# Altium project WatchX2_RoundScreen.PrjPcb
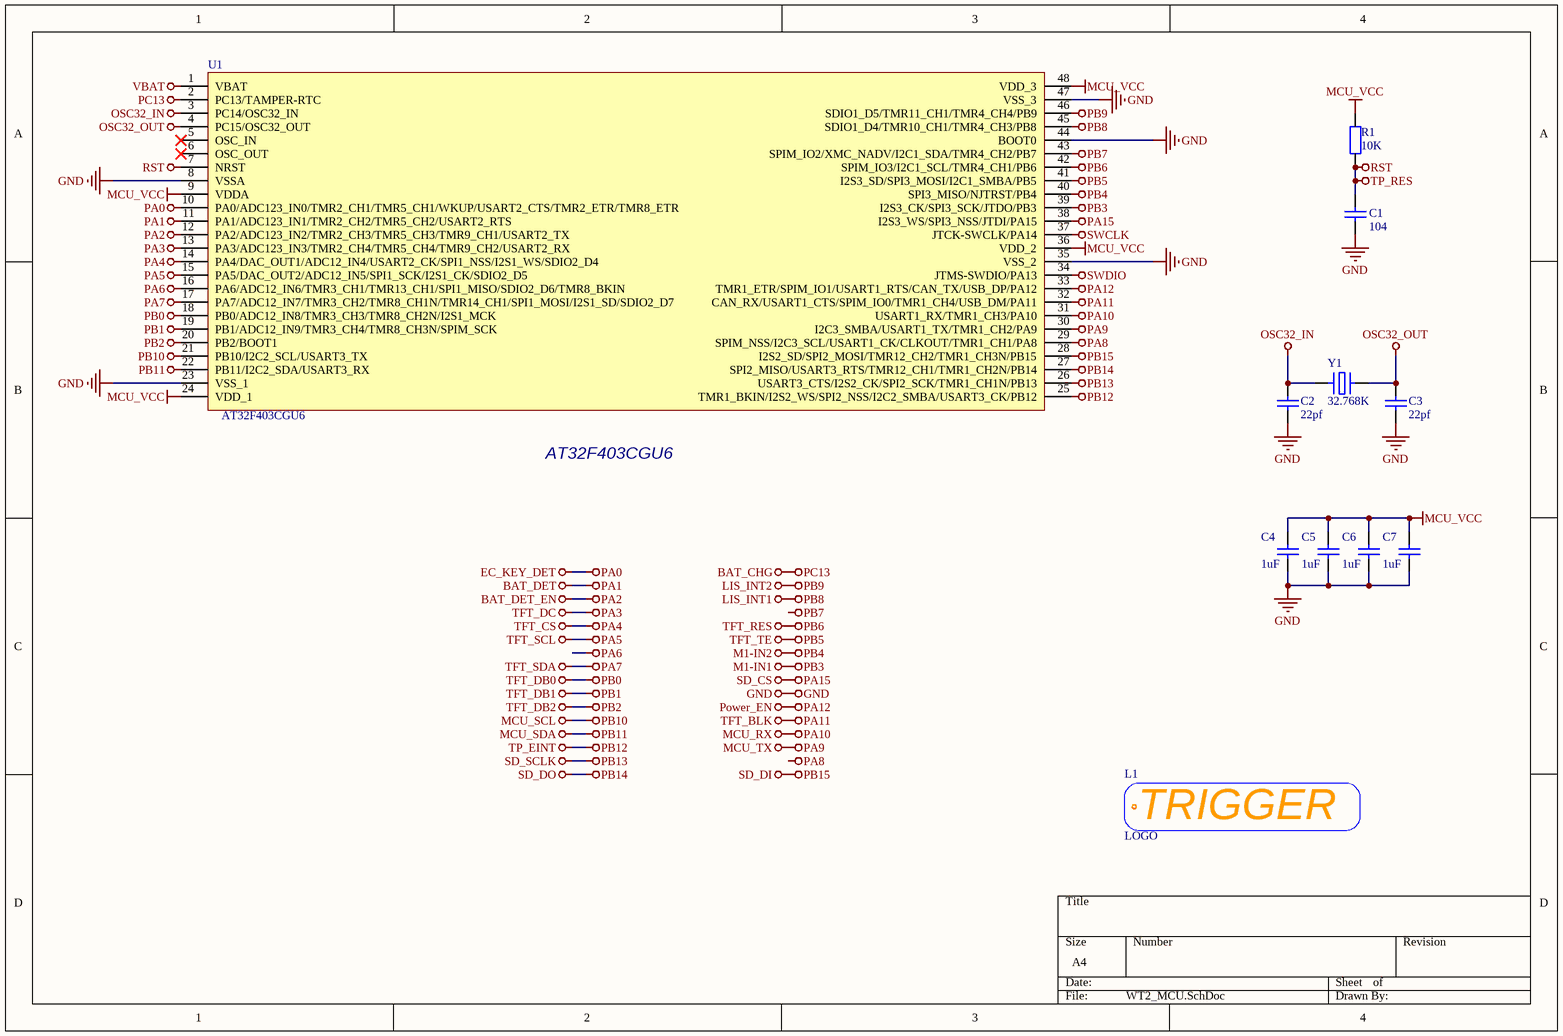
[diagram p0: WT2_MCU.SchDoc]
5 sheets, 92 parts. Net scope: global (net labels, ports and power ports of the same name join across sheets).
Board file: WatchX2_RoundScreen.PcbDoc
Sheets:
  WT2_MCU.SchDoc
  WT2_Ports.SchDoc
  WT2_Power.SchDoc
  WT2_Screen.SchDoc
  WT2_Sensors.SchDoc

## Sheet WT2_MCU.SchDoc
size A4

### Parts
C1  104  [电容_C0402]
C2  22pf  [电容_C0402]
C3  22pf  [电容_C0402]
C4  1uF  [电容_C0402]
C5  1uF  [电容_C0402]
C6  1uF  [电容_C0402]
C7  1uF  [电容_C0402]
L1  LOGO  [LOGO REV L BS]
R1  10K  [电阻_R0402]
U1  AT32F403CGU6  [AT主控_QFN48(6X6)]
Y1  32.768K  [晶振_3215]

### Nets
BAT_CHG: U1.2(PC13/TAMPER-RTC)  [also labelled PC13]
BAT_DET: U1.11(PA1/ADC123_IN1/TMR2_CH2/TMR5_CH2/USART2_RTS)  [also labelled PA1]
BAT_DET_EN: U1.12(PA2/ADC123_IN2/TMR2_CH3/TMR5_CH3/TMR9_CH1/USART2_TX)  [also labelled PA2]
EC_KEY_DET: U1.10(PA0/ADC123_IN0/TMR2_CH1/TMR5_CH1/WKUP/USART2_CTS/TMR2_ETR/TMR8_ETR)  [also labelled PA0]
GND: C1.1 C2.2 C3.2 C4.1 C5.1 C6.1 C7.1 U1.0(VSS) U1.8(VSSA) U1.23(VSS_1) U1.35(VSS_2) U1.44(BOOT0) U1.47(VSS_3)
LIS_INT1: U1.45(SDIO1_D4/TMR10_CH1/TMR4_CH3/PB8)  [also labelled PB8]
LIS_INT2: U1.46(SDIO1_D5/TMR11_CH1/TMR4_CH4/PB9)  [also labelled PB9]
M1-IN1: U1.39(I2S3_CK/SPI3_SCK/JTDO/PB3)  [also labelled PB3]
M1-IN2: U1.40(SPI3_MISO/NJTRST/PB4)  [also labelled PB4]
MCU_RX: U1.31(USART1_RX/TMR1_CH3/PA10)  [also labelled PA10]
MCU_SCL: U1.21(PB10/I2C2_SCL/USART3_TX)  [also labelled PB10]  [project net ASCL]
MCU_SDA: U1.22(PB11/I2C2_SDA/USART3_RX)  [also labelled PB11]  [project net ASDA]
MCU_TX: U1.30(I2C3_SMBA/USART1_TX/TMR1_CH2/PA9)  [also labelled PA9]
MCU_VCC: C4.2 C5.2 C6.2 C7.2 R1.2 U1.9(VDDA) U1.24(VDD_1) U1.36(VDD_2) U1.48(VDD_3)  [project net 3V3]
OSC32_IN: C2.1 U1.3(PC14/OSC32_IN) Y1.1
OSC32_OUT: C3.1 U1.4(PC15/OSC32_OUT) Y1.2
PA3: U1.13(PA3/ADC123_IN3/TMR2_CH4/TMR5_CH4/TMR9_CH2/USART2_RX)  [also labelled TFT_DC]
PA4: U1.14(PA4/DAC_OUT1/ADC12_IN4/USART2_CK/SPI1_NSS/I2S1_WS/SDIO2_D4)  [also labelled TFT_CS]
PA5: U1.15(PA5/DAC_OUT2/ADC12_IN5/SPI1_SCK/I2S1_CK/SDIO2_D5)  [also labelled TFT_SCL]
PA6: U1.16(PA6/ADC12_IN6/TMR3_CH1/TMR13_CH1/SPI1_MISO/SDIO2_D6/TMR8_BKIN)
PA7: U1.17(PA7/ADC12_IN7/TMR3_CH2/TMR8_CH1N/TMR14_CH1/SPI1_MOSI/I2S1_SD/SDIO2_D7)  [also labelled TFT_SDA]
PA8: U1.29(SPIM_NSS/I2C3_SCL/USART1_CK/CLKOUT/TMR1_CH1/PA8)
PA11: U1.32(CAN_RX/USART1_CTS/SPIM_IO0/TMR1_CH4/USB_DM/PA11)  [also labelled TFT_BLK]
PA12: U1.33(TMR1_ETR/SPIM_IO1/USART1_RTS/CAN_TX/USB_DP/PA12)  [also labelled Power_EN]
PB0: U1.18(PB0/ADC12_IN8/TMR3_CH3/TMR8_CH2N/I2S1_MCK)  [also labelled TFT_DB0]
PB1: U1.19(PB1/ADC12_IN9/TMR3_CH4/TMR8_CH3N/SPIM_SCK)  [also labelled TFT_DB1]
PB2: U1.20(PB2/BOOT1)  [also labelled TFT_DB2]
PB5: U1.41(I2S3_SD/SPI3_MOSI/I2C1_SMBA/PB5)  [also labelled TFT_TE]
PB6: U1.42(SPIM_IO3/I2C1_SCL/TMR4_CH1/PB6)  [also labelled TFT_RES]
PB7: U1.43(SPIM_IO2/XMC_NADV/I2C1_SDA/TMR4_CH2/PB7)
PB12: U1.25(TMR1_BKIN/I2S2_WS/SPI2_NSS/I2C2_SMBA/USART3_CK/PB12)  [also labelled TP_EINT]
RST: C1.2 R1.1 U1.7(NRST)  [also labelled TP_RES]
SD_CS: U1.38(I2S3_WS/SPI3_NSS/JTDI/PA15)  [also labelled PA15]
SD_DI: U1.28(I2S2_SD/SPI2_MOSI/TMR12_CH2/TMR1_CH3N/PB15)  [also labelled PB15]
SD_DO: U1.27(SPI2_MISO/USART3_RTS/TMR12_CH1/TMR1_CH2N/PB14)  [also labelled PB14]
SD_SCLK: U1.26(USART3_CTS/I2S2_CK/SPI2_SCK/TMR1_CH1N/PB13)  [also labelled PB13]
SWCLK: U1.37(JTCK-SWCLK/PA14)
SWDIO: U1.34(JTMS-SWDIO/PA13)
VBAT: U1.1(VBAT)

Not connected (* = marked no-connect by the designer): U1 5(OSC_IN)* 6(OSC_OUT)*

### Notes on the sheet
- (near U1) AT32F403CGU6
- Labels drawn without touching a wire or pin: PA8, PB7
- (in symbol LOGO_TRIGGER) TRIGGER

### Library data of the parts
C1-C7 = cap: U: 50V; 参数: Cap,0805,X7R,104K,50V,125C,±10%
  C1: C: 104
  C2 C3: C: 22pf
  C4-C7: C: 1uF
L1 = LOGO_TRIGGER
R1 = Res: P: 1/8W; 参数: Res,0805,0R,±1%,1/8W,100ppm,155C; R: 10K
U1 = AT32F403CGU6: _Footprint: QFN48; _Comma: ,; _Name: MCU; _Specification: MCU,AT32F403CGU6,QFN48; _Model: AT32F403CGU6
Y1 = XTAL_A: _Name: CRYSTALS; _Comma: ,; _Specification: CRYSTALS,32.768K,*,10ppm,12pF; _Accuracy: 10ppm; _CL: 12pF; _Footprint: *; _Frequency: 32.768K

## Sheet WT2_Ports.SchDoc
size A4
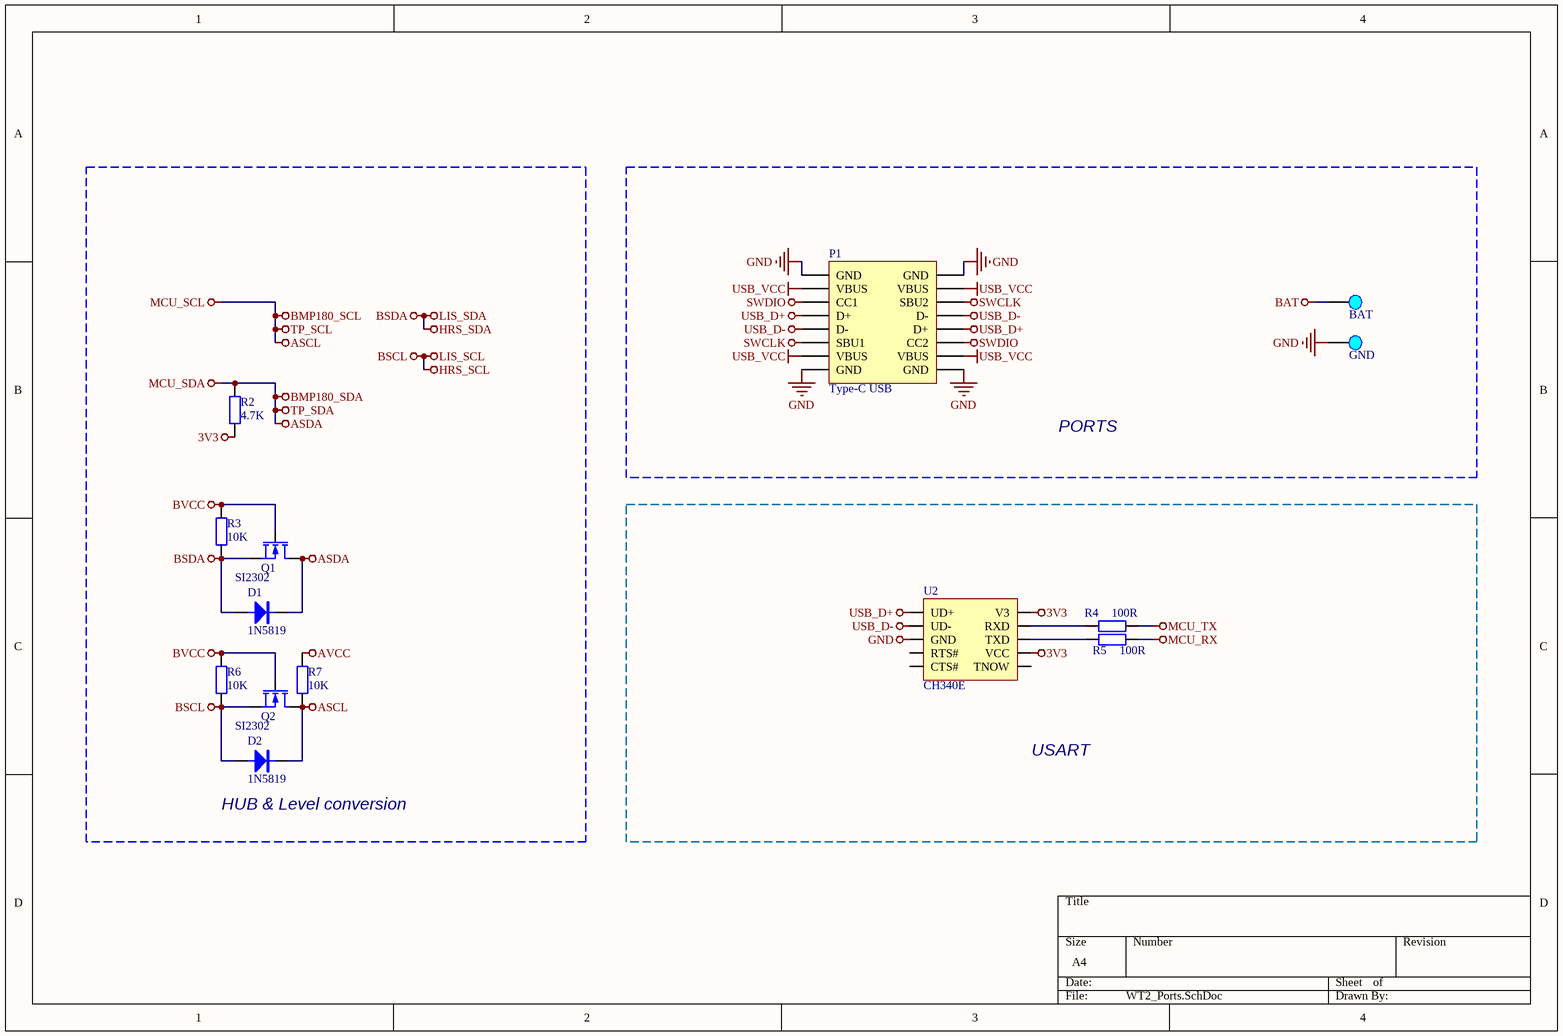
[diagram p1: WT2_Ports.SchDoc]

### Parts
D1  1N5819  [二极管_SOD-323]
D2  1N5819  [二极管_SOD-323]
P1  Type-C USB  [Type-C_16P]
Pad1  BAT  [Pad_A]
Pad2  GND  [Pad_A]
Q1  SI2302  [MOS_SOT-23]
Q2  SI2302  [MOS_SOT-23]
R2  4.7K  [电阻_R0402]
R3  10K  [电阻_R0402]
R4  100R  [电阻_R0402]
R5  100R  [电阻_R0402]
R6  10K  [电阻_R0402]
R7  10K  [电阻_R0402]
U2  CH340E  [MSOP10]

### Blocks framed on the sheet
HUB & Level conversion: D1 D2 Q1 Q2 R2 R3 R6 R7
PORTS: P1 Pad1 Pad2
USART: R4 R5 U2

### Nets
3V3: R2.1 R7.1 U2.7(VCC) U2.10(V3)  [also labelled AVCC]
ASCL: D2.K Q2.2(D) R7.2  [also labelled BMP180_SCL, MCU_SCL, TP_SCL]
ASDA: D1.K Q1.2(D) R2.2  [also labelled BMP180_SDA, MCU_SDA, TP_SDA]
BAT: Pad1.1
BSCL: D2.A Q2.3(S) R6.2  [also labelled HRS_SCL, LIS_SCL]
BSDA: D1.A Q1.3(S) R3.2  [also labelled HRS_SDA, LIS_SDA]
BVCC: Q1.1(G) Q2.1(G) R3.1 R6.1  [project net 1.8V]
GND: P1.0(GND) P1.A1(GND) P1.A12(GND) P1.B1(GND) P1.B12(GND) Pad2.1 U2.3(GND)
MCU_RX: R5.1
MCU_TX: R4.1
SWCLK: P1.A8(SBU1) P1.B8(SBU2)
SWDIO: P1.A5(CC1) P1.B5(CC2)
USB_D+: P1.A6(D+) P1.B6(D+) U2.1(UD+)
USB_D-: P1.A7(D-) P1.B7(D-) U2.2(UD-)
USB_VCC: P1.A4(VBUS) P1.A9(VBUS) P1.B4(VBUS) P1.B9(VBUS)
NetR4_2: R4.2 U2.9(RXD)
NetR5_2: R5.2 U2.8(TXD)

Not connected (* = marked no-connect by the designer): U2 4(RTS#) 5(CTS#) 6(TNOW)

### Library data of the parts
D1 D2 = Diode: _Specification: Diode,1N5819,SOD-323,1A,40V; _Comma: ,; _Footprint: SOD-323; _Voltage: 40V; _Current: 1A; _Name: Diode; _Model: 1N5819
P1 = Type-C USB Easy 16PIN: _Comma: ,; _Name: Port; _Specification: Port,Type-C USB,16PIN; _Value: 16PIN; _Model: Type-C USB
Pad1 = Pad: _Funcyusa: Test; _Specification: Pad,Test,BAT; _Comma: ,; _Name: Pad; _Remarks: BAT
Pad2 = Pad: _Funcyusa: Test; _Specification: Pad,Test,GND; _Comma: ,; _Name: Pad; _Remarks: GND
Q1 Q2 = MOSFET-N: _Comma: ,; _Current: 150A; _Footprint: DFN5*6; _Name: N-MOSFET; _Specification: N-MOSFET,SI2302,DFN5*6,150A,30V; _Voltage: 30V; _Model: SI2302
R2-R7 = Res: as R1 on sheet WT2_MCU
  R2: R: 4.7K
  R3 R6 R7: R: 10K
  R4 R5: R: 100R

## Sheet WT2_Power.SchDoc
size A4
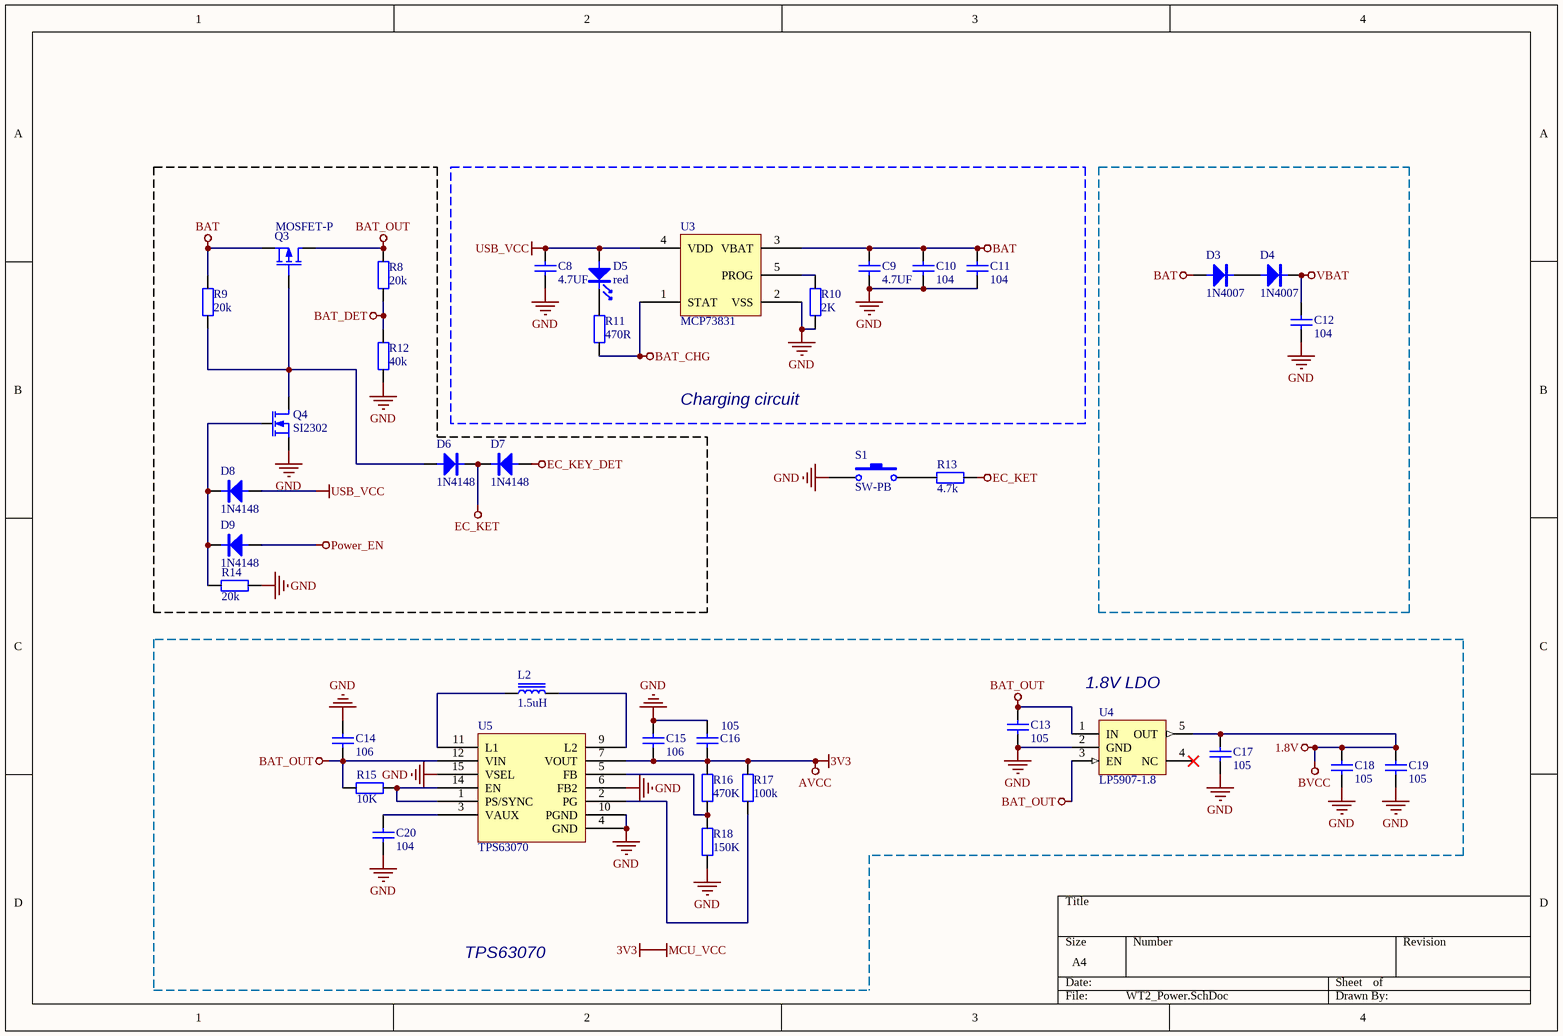
[diagram p2: WT2_Power.SchDoc]

### Parts
C8  4.7UF  [电容_C0805]
C9  4.7UF  [电容_C0805]
C10  104  [电容_C0402]
C11  104  [电容_C0402]
C12  104  [电容_C0402]
C13  105  [电容_C0402]
C14  106  [电容_C0805]
C15  106  [电容_C0603]
C16  105  [电容_C0402]
C17  105  [电容_C0402]
C18  105  [电容_C0402]
C19  105  [电容_C0402]
C20  104  [电容_C0402]
D3  1N4007  [二极管_SOD-323]
D4  1N4007  [二极管_SOD-323]
D5  red  [LED_0603]
D6  1N4148  [二极管_SOD-323]
D7  1N4148  [二极管_SOD-323]
D8  1N4148  [二极管_SOD-323]
D9  1N4148  [二极管_SOD-323]
L2  1.5uH  [变压器电感_0420]
Q3  MOSFET-P  [SOT23]
Q4  SI2302  [MOS_SOT-23]
R8  20k  [电阻_R0402]
R9  20k  [电阻_R0402]
R10  2K  [电阻_R0402]
R11  470R  [电阻_R0402]
R12  40k  [电阻_R0402]
R13  4.7k  [电阻_R0402]
R14  20k  [电阻_R0402]
R15  10K  [电阻_R0402]
R16  470K  [电阻_R0402]
R17  100k  [电阻_R0402]
R18  150K  [电阻_R0402]
S1  SW-PB  [KEY-TE26EA]
U3  MCP73831  [SOT23-5]
U4  LP5907-1.8  [SOT23-5]
U5  TPS63070  [VQFN-15-HR]

### Blocks framed on the sheet
Charging circuit: C8-C11 D5 R10 R11 U3

### Nets
1.8V: C17.2 C18.2 C19.2 U4.5(OUT)  [also labelled BVCC]
3V3: C15.1 C16.1 R16.1 R17.1 U5.7(VOUT)  [also labelled AVCC, MCU_VCC]
BAT: C9.2 C10.1 C11.1 D3.A Q3.3(S) R9.2 U3.3(VBAT)
BAT_CHG: R11.1 U3.1(STAT)
BAT_DET: R8.1 R12.2
BAT_OUT: C13.2 C14.1 Q3.2(D) R8.2 R15.2 U4.1(IN) U4.3(EN) U5.12(VIN)
EC_KET: D6.K D7.K R13.1
EC_KEY_DET: D7.A
GND: C8.1 C9.1 C10.2 C11.2 C12.2 C13.1 C14.2 C15.2 C16.2 C17.1 C18.1 C19.1 C20.1 Q4.3(S) R10.1 R12.1 R14.1 R18.2 S1.1 U3.2(VSS) U4.2(GND) U5.4(GND) U5.6(FB2) U5.10(PGND) U5.15(VSEL)
Power_EN: D9.A  [project net PA12]
USB_VCC: C8.2 D5.A D8.A U3.4(VDD)
VBAT: C12.1 D4.K
NetC20_2: C20.2 U5.3(VAUX)
NetD3_K: D3.K D4.A
NetD5_K: D5.K R11.2
NetD6_A: D6.A Q3.1(G) Q4.2(D) R9.1
NetD8_K: D8.K D9.K Q4.1(G) R14.2
NetL2_1: L2.1 U5.11(L1)
NetL2_2: L2.2 U5.9(L2)
NetR10_2: R10.2 U3.5(PROG)
NetR13_2: R13.2 S1.2
NetR15_1: R15.1 U5.1(PS/SYNC) U5.14(EN)
NetR16_2: R16.2 R18.1 U5.5(FB)
NetR17_2: R17.2 U5.2(PG)

Not connected (* = marked no-connect by the designer): U4 4(NC)*

### Notes on the sheet
- (near U4) 1.8V LDO
- TPS63070

### Library data of the parts
C8-C20 = cap: as C1 on sheet WT2_MCU
  C8 C9: C: 4.7UF
  C10-C12 C20: C: 104
  C13 C16-C19: C: 105
  C14 C15: C: 106
D3 D4 = Diode: _Specification: Diode,1N4007,SOD-323,1A,40V; _Comma: ,; _Footprint: SOD-323; _Voltage: 40V; _Current: 1A; _Name: Diode; _Model: 1N4007
D5 = LED: 参数: LED,0603,Red
D6-D9 = Diode: _Specification: Diode,1N4148,SOD-323,1A,40V; _Comma: ,; _Footprint: SOD-323; _Voltage: 40V; _Current: 1A; _Name: Diode; _Model: 1N4148
L2 = Inductor Iron 2: _Current: 10A; _Accuracy: 20%; _Footprint: 1040; _Name: IND; _Specification: IND,1040,1.5uH,10A,20%; _Comma: ,; _Value: 1.5uH
Q3 = MOSFET-P: P-Channel MOSFET; Published: 8-Jun-2000; LatestRevisionDate: 17-Jul-2002; LatestRevisionNote: Re-released for DXP Platform.; PackageVersion: 1995/1996; PackageReference: E3; Publisher: Altium Limited; PackageDescription: TO, Flat Index; 3 In-Line, Axial Leads; Body Dia. 4.6mm; Lead Dia. 0.5 mm (max)
Q4 = MOSFET-N: as Q1 on sheet WT2_Ports; _Model: SI2302
R8-R18 = Res: as R1 on sheet WT2_MCU
  R8 R9 R14: R: 20k
  R10: R: 2K
  R11: R: 470R
  R12: R: 40k
  R13: R: 4.7k
  R15: R: 10K
  R16: R: 470K
  R17: R: 100k
  R18: R: 150K
S1 = SW-PB: 按键
U3 = MCP73831: 线性充电管理控制器
U4 = LP5907: LDO
U5 = TPS63070: 降压-升压转换器

## Sheet WT2_Screen.SchDoc
size A4
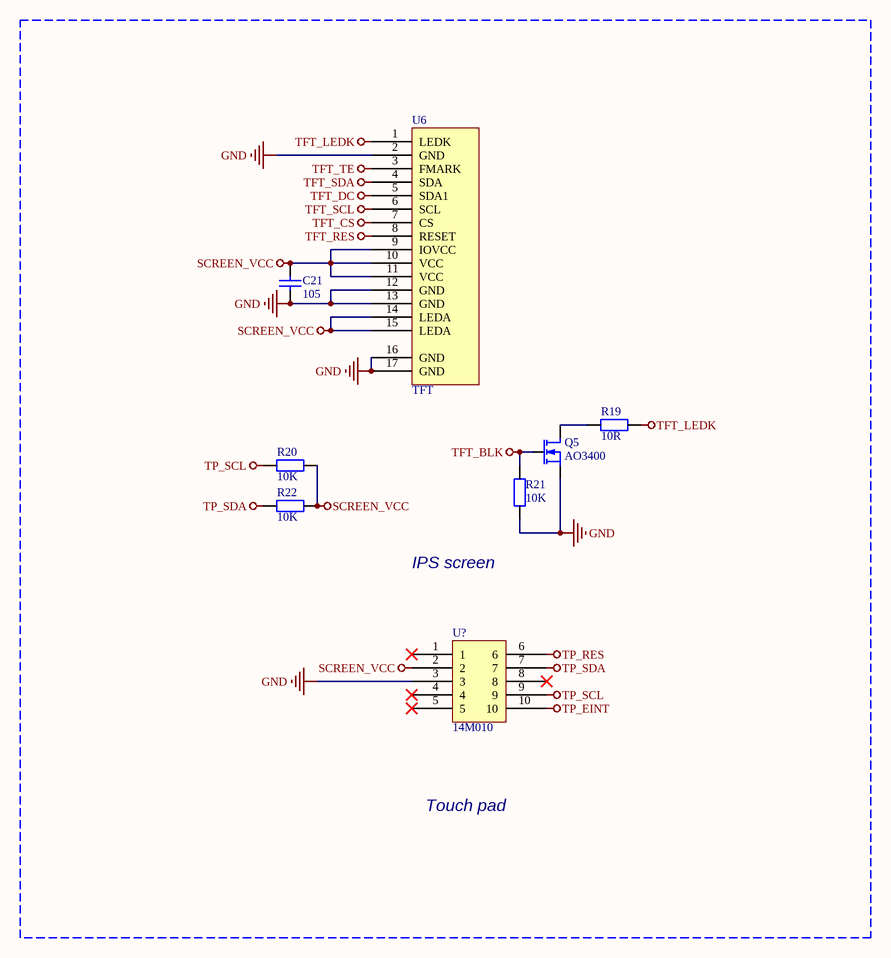
[diagram p3: WT2_Screen.SchDoc]

### Parts
C21  105  [电容_C0603]
Q5  AO3400  [MOS_SOT-23]
R19  10R  [电阻_R0402]
R20  10K  [电阻_R0402]
R21  10K  [电阻_R0402]
R22  10K  [电阻_R0402]
U6  TFT  [FPC-0.30mm-15P]
U?  14M010  [OK-14F010 10PIN]

### Nets
GND: C21.2 Q5.3(S) R21.1 U6.2(GND) U6.12(GND) U6.13(GND) U6.16(GND) U6.17(GND) U?.3
SCREEN_VCC: C21.1 R20.1 R22.1 U6.9(IOVCC) U6.10(VCC) U6.11(VCC) U6.14(LEDA) U6.15(LEDA) U?.2
TFT_BLK: Q5.1(G) R21.2  [project net PA11]
TFT_CS: U6.7(CS)  [project net PA4]
TFT_DC: U6.5(SDA1)  [project net PA3]
TFT_LEDK: R19.2 U6.1(LEDK)
TFT_RES: U6.8(RESET)  [project net PB6]
TFT_SCL: U6.6(SCL)  [project net PA5]
TFT_SDA: U6.4(SDA)  [project net PA7]
TFT_TE: U6.3(FMARK)  [project net PB5]
TP_EINT: U?.10  [project net PB12]
TP_RES: U?.6  [project net RST]
TP_SCL: R20.2 U?.9  [project net ASCL]
TP_SDA: R22.2 U?.7  [project net ASDA]
NetQ5_2: Q5.2(D) R19.1

Not connected (* = marked no-connect by the designer): U? 1* 4* 5* 8*

### Notes on the sheet
- IPS screen
- Touch pad

### Library data of the parts
C21 = cap: as C1 on sheet WT2_MCU; C: 105
Q5 = MOSFET-N: _Comma: ,; _Current: 150A; _Footprint: DFN5*6; _Name: N-MOSFET; _Specification: N-MOSFET,AO3400,DFN5*6,150A,30V; _Voltage: 30V; _Model: AO3400
R19 = Res: _Accuracy: 1%; _Power: 1/8W; _Footprint: 0805; _Drift: 100ppm; _Comma: ,; _Specification: Res,0805,10R,1%,1/8W,100ppm; _Name: Res; _Value: 10R
R20-R22 = Res: _Accuracy: 1%; _Power: 1/8W; _Footprint: 0805; _Drift: 100ppm; _Comma: ,; _Specification: Res,0805,10K,1%,1/8W,100ppm; _Name: Res; _Value: 10K
U6 = TFT_IPS1-1.54寸240*240-AML015410V1: IPS电容式触摸屏
U? = OK-14M010-04: 奇亚板对板连接器

## Sheet WT2_Sensors.SchDoc
size A4
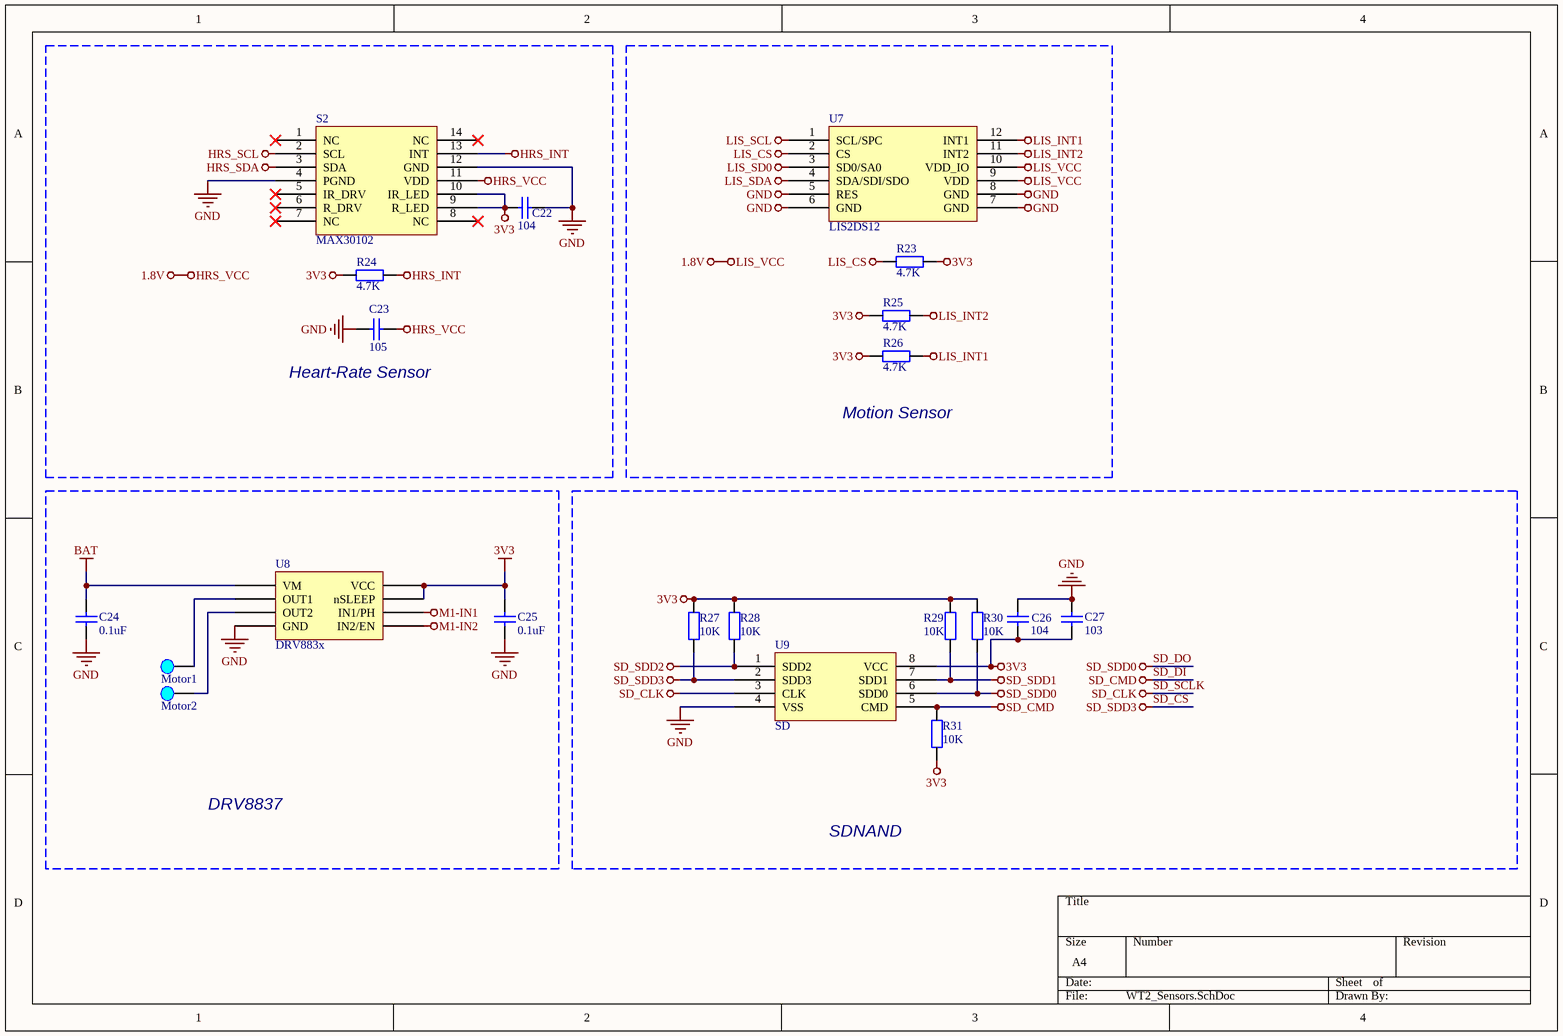
[diagram p4: WT2_Sensors.SchDoc]

### Parts
C22  104  [电容_C0402]
C23  105  [电容_C0402]
C24  0.1uF  [电容_C0402]
C25  0.1uF  [电容_C0402]
C26  104  [电容_C0402]
C27  103  [电容_C0402]
Pad3  Motor1  [Pad_A]
Pad4  Motor2  [Pad_A]
R23  4.7K  [电阻_R0402]
R24  4.7K  [电阻_R0402]
R25  4.7K  [电阻_R0402]
R26  4.7K  [电阻_R0402]
R27  10K  [电阻_R0402]
R28  10K  [电阻_R0402]
R29  10K  [电阻_R0402]
R30  10K  [电阻_R0402]
R31  10K  [电阻_R0402]
S2  MAX30102  [MAX30102]
U7  LIS2DS12  [LGA-12_2*2mm]
U8  DRV883x  [WSON-8_2*2]
U9  SD  [LGA-8_6*8mm2]

### Blocks framed on the sheet
Heart-Rate Sensor: C22 C23 R24 S2
Motion Sensor: R23 R25 R26 U7
DRV8837: C24 C25 Pad3 Pad4 U8
SDNAND: C26 C27 R27-R31 U9

### Nets
1.8V: C23.1 S2.11(VDD) U7.9(VDD) U7.10(VDD_IO)  [also labelled HRS_VCC, LIS_VCC]
3V3: C22.2 C25.2 C26.1 C27.1 R23.1 R24.2 R25.2 R26.2 R27.1 R28.1 R29.1 R30.1 R31.2 S2.9(R_LED) S2.10(IR_LED) U8.7(nSLEEP) U8.8(VCC) U9.8(VCC)
BAT: C24.1 U8.1(VM)
GND: C22.1 C23.2 C24.2 C25.1 C26.2 C27.2 S2.4(PGND) S2.12(GND) U7.5(RES) U7.6(GND) U7.7(GND) U7.8(GND) U8.4(GND) U9.4(VSS)
HRS_INT: R24.1 S2.13(INT)
HRS_SCL: S2.2(SCL) U7.1(SCL/SPC)  [also labelled LIS_SCL]  [project net BSCL]
HRS_SDA: S2.3(SDA) U7.4(SDA/SDI/SDO)  [also labelled LIS_SDA]  [project net BSDA]
LIS_CS: R23.2 U7.2(CS)
LIS_INT1: R26.1 U7.12(INT1)
LIS_INT2: R25.1 U7.11(INT2)
LIS_SD0: U7.3(SD0/SA0)
M1-IN1: U8.6(IN1/PH)
M1-IN2: U8.5(IN2/EN)
SD_CS: R27.2 U9.2(SDD3)  [also labelled SD_SDD3]
SD_DI: R31.1 U9.5(CMD)  [also labelled SD_CMD]
SD_DO: R30.2 U9.6(SDD0)  [also labelled SD_SDD0]
SD_SCLK: U9.3(CLK)  [also labelled SD_CLK]
SD_SDD1: R29.2 U9.7(SDD1)
SD_SDD2: R28.2 U9.1(SDD2)
NetPad3_1: Pad3.1 U8.2(OUT1)
NetPad4_1: Pad4.1 U8.3(OUT2)

Not connected (* = marked no-connect by the designer): S2 1(NC)* 5(IR_DRV)* 6(R_DRV)* 7(NC)* 8(NC)* 14(NC)*

### Library data of the parts
C22-C27 = cap: as C1 on sheet WT2_MCU
  C22 C26: C: 104
  C23: C: 105
  C24 C25: C: 0.1uF
  C27: C: 103
Pad3 = Pad: _Funcyusa: Test; _Specification: Pad,Test,Motor1; _Comma: ,; _Name: Pad; _Remarks: Motor1
Pad4 = Pad: _Funcyusa: Test; _Specification: Pad,Test,Motor2; _Comma: ,; _Name: Pad; _Remarks: Motor2
R23-R31 = Res: as R1 on sheet WT2_MCU
  R23-R26: R: 4.7K
  R27-R31: R: 10K
S2 = MAX30102: 血氧浓度传感器
U7 = LIS2DS12: 运动传感器
U9 = SDNAND

## Nets that join several sheets
1.8V: WT2_Ports (Q1.1 Q2.1 R3.1 R6.1), WT2_Power (C17.2 C18.2 C19.2 U4.5), WT2_Sensors (C23.1 S2.11 U7.9 U7.10)
3V3: WT2_MCU (9 pins), WT2_Ports (R2.1 R7.1 U2.7 U2.10), WT2_Power (5 pins), WT2_Sensors (18 pins)
ASCL: WT2_MCU (U1.21), WT2_Ports (D2.K Q2.2 R7.2), WT2_Screen (R20.2 U?.9)
ASDA: WT2_MCU (U1.22), WT2_Ports (D1.K Q1.2 R2.2), WT2_Screen (R22.2 U?.7)
BAT: WT2_Ports (Pad1.1), WT2_Power (7 pins), WT2_Sensors (C24.1 U8.1)
BAT_CHG: WT2_MCU (U1.2), WT2_Power (R11.1 U3.1)
BAT_DET: WT2_MCU (U1.11), WT2_Power (R8.1 R12.2)
BSCL: WT2_Ports (D2.A Q2.3 R6.2), WT2_Sensors (S2.2 U7.1)
BSDA: WT2_Ports (D1.A Q1.3 R3.2), WT2_Sensors (S2.3 U7.4)
EC_KEY_DET: WT2_MCU (U1.10), WT2_Power (D7.A)
GND: WT2_MCU (13 pins), WT2_Ports (7 pins), WT2_Power (25 pins), WT2_Screen (9 pins), WT2_Sensors (14 pins)
LIS_INT1: WT2_MCU (U1.45), WT2_Sensors (R26.1 U7.12)
LIS_INT2: WT2_MCU (U1.46), WT2_Sensors (R25.1 U7.11)
M1-IN1: WT2_MCU (U1.39), WT2_Sensors (U8.6)
M1-IN2: WT2_MCU (U1.40), WT2_Sensors (U8.5)
MCU_RX: WT2_MCU (U1.31), WT2_Ports (R5.1)
MCU_TX: WT2_MCU (U1.30), WT2_Ports (R4.1)
PA3: WT2_MCU (U1.13), WT2_Screen (U6.5)
PA4: WT2_MCU (U1.14), WT2_Screen (U6.7)
PA5: WT2_MCU (U1.15), WT2_Screen (U6.6)
PA7: WT2_MCU (U1.17), WT2_Screen (U6.4)
PA11: WT2_MCU (U1.32), WT2_Screen (Q5.1 R21.2)
PA12: WT2_MCU (U1.33), WT2_Power (D9.A)
PB5: WT2_MCU (U1.41), WT2_Screen (U6.3)
PB6: WT2_MCU (U1.42), WT2_Screen (U6.8)
PB12: WT2_MCU (U1.25), WT2_Screen (U?.10)
RST: WT2_MCU (C1.2 R1.1 U1.7), WT2_Screen (U?.6)
SD_CS: WT2_MCU (U1.38), WT2_Sensors (R27.2 U9.2)
SD_DI: WT2_MCU (U1.28), WT2_Sensors (R31.1 U9.5)
SD_DO: WT2_MCU (U1.27), WT2_Sensors (R30.2 U9.6)
SD_SCLK: WT2_MCU (U1.26), WT2_Sensors (U9.3)
SWCLK: WT2_MCU (U1.37), WT2_Ports (P1.A8 P1.B8)
SWDIO: WT2_MCU (U1.34), WT2_Ports (P1.A5 P1.B5)
USB_VCC: WT2_Ports (P1.A4 P1.A9 P1.B4 P1.B9), WT2_Power (C8.2 D5.A D8.A U3.4)
VBAT: WT2_MCU (U1.1), WT2_Power (C12.1 D4.K)